# Altium schematic sheet I2C_Switch_temp_sens.SchDoc: Sayma RTM
size 420 x 297 mm; Author: G.Kasprowicz; CompanyName: WUT ISE; DrawnBy: G.Kasprowicz; Organization: WUT ISE; Address1: PW ISE; Address2: Nowowiejska 15/19 00-665 Warsaw; Address3: gkasprow@gmail.com; DocumentNumber: 18; Revision: 1.0; SheetNumber: 18; SheetTotal: 18; ModifiedBy: -; CheckedDate: -; Title2: I2C switches & sensors; DivGrp: WUT ISE; Designer: G.Kasprowicz; ModifiedDate: -; ProjectName: Sensor Box
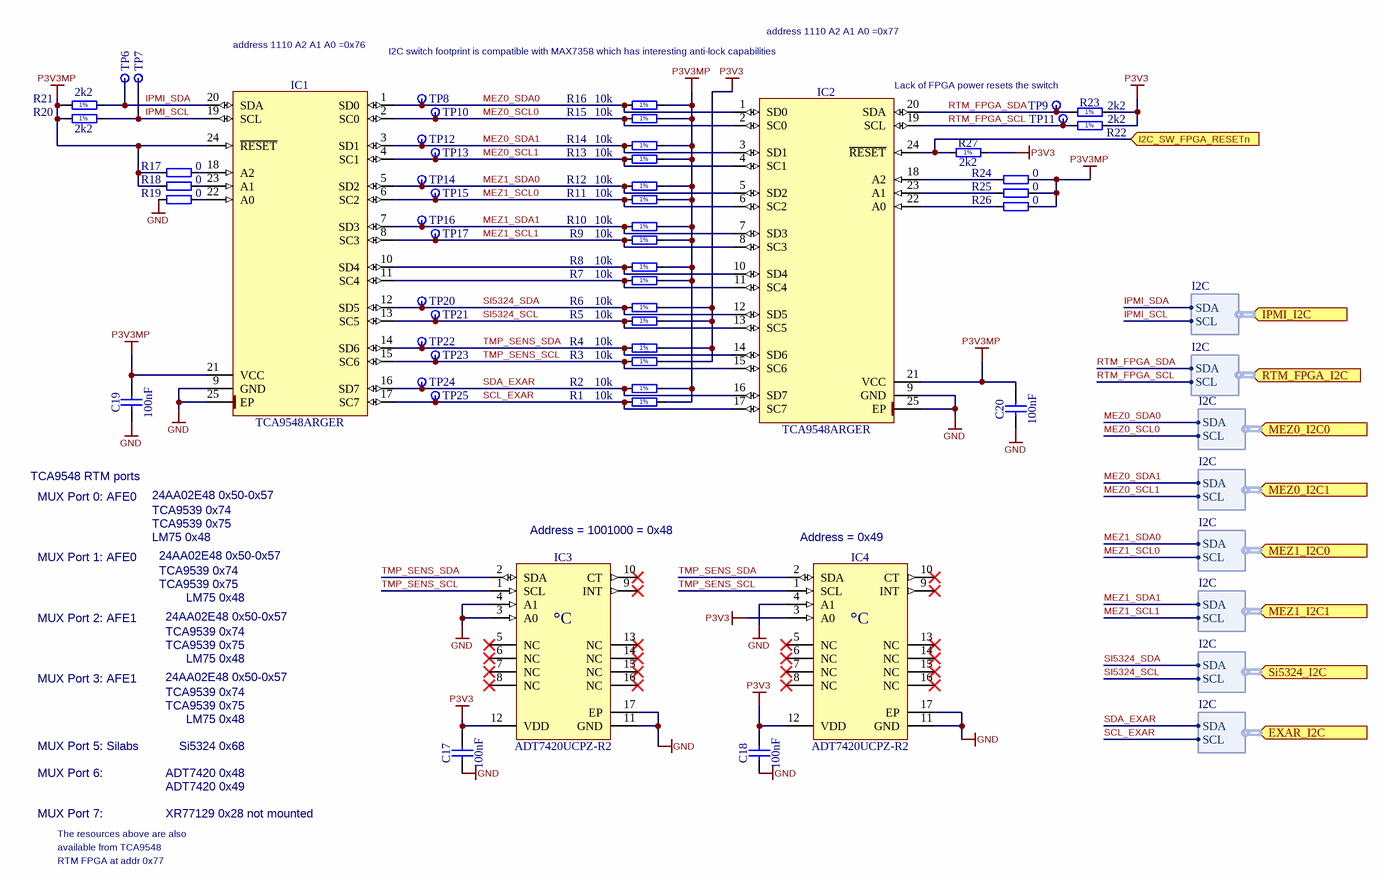
[diagram p0: I2C_Switch_temp_sens.SchDoc]

## Parts
C17  100nF  [CAPC0603X33N]
C18  100nF  [CAPC0603X33N]
C19  100nF  [CAPC0603X33N]
C20  100nF  [CAPC0603X33N]
IC1  TCA9548ARGER  [QFN50P400X400X100-25N-S220]
IC2  TCA9548ARGER  [QFN50P400X400X100-25N-S220]
IC3  ADT7420UCPZ-R2  [QFN65P400X400X80-17N-S270]
IC4  ADT7420UCPZ-R2  [QFN65P400X400X80-17N-S270]
R1  10k  [RESC1005X40N]
R2  10k  [RESC1005X40N]
R3  10k  [RESC1005X40N]
R4  10k  [RESC1005X40N]
R5  10k  [RESC1005X40N]
R6  10k  [RESC1005X40N]
R7  10k  [RESC1005X40N]
R8  10k  [RESC1005X40N]
R9  10k  [RESC1005X40N]
R10  10k  [RESC1005X40N]
R11  10k  [RESC1005X40N]
R12  10k  [RESC1005X40N]
R13  10k  [RESC1005X40N]
R14  10k  [RESC1005X40N]
R15  10k  [RESC1005X40N]
R16  10k  [RESC1005X40N]
R17  0  [RESC1005X40N]
R18  0  [RESC1005X40N]
R19  0  [RESC1005X40N]
R20  2k2  [RESC1005X40N]
R21  2k2  [RESC1005X40N]
R22  2k2  [RESC1005X40N]
R23  2k2  [RESC1005X40N]
R24  0  [RESC1005X40N]
R25  0  [RESC1005X40N]
R26  0  [RESC1005X40N]
R27  2k2  [RESC1005X40N]
TP6  Test Point  [TPS127]  (value not drawn)
TP7  Test Point  [TPS127]  (value not drawn)
TP8  Test Point  [TPS127]  (value not drawn)
TP9  Test Point  [TPS127]  (value not drawn)
TP10  Test Point  [TPS127]  (value not drawn)
TP11  Test Point  [TPS127]  (value not drawn)
TP12  Test Point  [TPS127]  (value not drawn)
TP13  Test Point  [TPS127]  (value not drawn)
TP14  Test Point  [TPS127]  (value not drawn)
TP15  Test Point  [TPS127]  (value not drawn)
TP16  Test Point  [TPS127]  (value not drawn)
TP17  Test Point  [TPS127]  (value not drawn)
TP20  Test Point  [TPS127]  (value not drawn)
TP21  Test Point  [TPS127]  (value not drawn)
TP22  Test Point  [TPS127]  (value not drawn)
TP23  Test Point  [TPS127]  (value not drawn)
TP24  Test Point  [TPS127]  (value not drawn)
TP25  Test Point  [TPS127]  (value not drawn)

## Ports
EXAR_I2C (in, harness I2C), I2C_SW_FPGA_RESETn (in), IPMI_I2C (in, harness I2C), MEZ0_I2C0 (in, harness I2C), MEZ0_I2C1 (in, harness I2C), MEZ1_I2C0 (in, harness I2C), MEZ1_I2C1 (in, harness I2C), RTM_FPGA_I2C (in, harness I2C), Si5324_I2C (in, harness I2C)

## Harnesses
I2C: SDA, SCL

## Nets
GND: C17.1 C18.1 C19.1 C20.1 IC1.9(GND) IC1.25(EP) IC2.9(GND) IC2.25(EP) IC3.3(A0) IC3.4(A1) IC3.11(GND) IC3.17(EP) IC4.4(A1) IC4.11(GND) IC4.17(EP) R19.1
P3V3: C17.2 C18.2 IC3.12(VDD) IC4.3(A0) IC4.12(VDD) R3.2 R4.2 R5.2 R6.2 R22.2 R23.2 R27.2
P3V3MP: C19.2 C20.2 IC1.21(VCC) IC1.24(~{RESET}) IC2.21(VCC) R1.2 R2.2 R7.2 R8.2 R9.2 R10.2 R11.2 R12.2 R13.2 R14.2 R15.2 R16.2 R17.1 R18.1 R20.1 R21.1 R24.2 R25.2 R26.2
I2C_SW_FPGA_RESETn: IC2.24(~{RESET}) R27.1 ; port I2C_SW_FPGA_RESETn
IPMI_SCL: IC1.19(SCL) R20.2 TP7.1 ; port IPMI_I2C.SCL
IPMI_SDA: IC1.20(SDA) R21.2 TP6.1 ; port IPMI_I2C.SDA
MEZ0_SCL0: IC1.2(SC0) IC2.2(SC0) R15.1 TP10.1 ; port MEZ0_I2C0.SCL
MEZ0_SCL1: IC1.4(SC1) IC2.4(SC1) R13.1 TP13.1 ; port MEZ0_I2C1.SCL
MEZ0_SDA0: IC1.1(SD0) IC2.1(SD0) R16.1 TP8.1 ; port MEZ0_I2C0.SDA
MEZ0_SDA1: IC1.3(SD1) IC2.3(SD1) R14.1 TP12.1 ; port MEZ0_I2C1.SDA
MEZ1_SCL0: IC1.6(SC2) IC2.6(SC2) R11.1 TP15.1 ; port MEZ1_I2C0.SCL
MEZ1_SCL1: IC1.8(SC3) IC2.8(SC3) R9.1 TP17.1 ; port MEZ1_I2C1.SCL
MEZ1_SDA0: IC1.5(SD2) IC2.5(SD2) R12.1 TP14.1 ; port MEZ1_I2C0.SDA
MEZ1_SDA1: IC1.7(SD3) IC2.7(SD3) R10.1 TP16.1 ; port MEZ1_I2C1.SDA
RTM_FPGA_SCL: IC2.19(SCL) R22.1 TP11.1 ; port RTM_FPGA_I2C.SCL
RTM_FPGA_SDA: IC2.20(SDA) R23.1 TP9.1 ; port RTM_FPGA_I2C.SDA
SCL_EXAR: IC1.17(SC7) IC2.17(SC7) R1.1 TP25.1 ; port EXAR_I2C.SCL
SDA_EXAR: IC1.16(SD7) IC2.16(SD7) R2.1 TP24.1 ; port EXAR_I2C.SDA
SI5324_SCL: IC1.13(SC5) IC2.13(SC5) R5.1 TP21.1 ; port Si5324_I2C.SCL
SI5324_SDA: IC1.12(SD5) IC2.12(SD5) R6.1 TP20.1 ; port Si5324_I2C.SDA
TMP_SENS_SCL: IC1.15(SC6) IC2.15(SC6) IC3.1(SCL) IC4.1(SCL) R3.1 TP23.1
TMP_SENS_SDA: IC1.14(SD6) IC2.14(SD6) IC3.2(SDA) IC4.2(SDA) R4.1 TP22.1
NetIC1_10: IC1.10(SD4) IC2.10(SD4) R8.1
NetIC1_11: IC1.11(SC4) IC2.11(SC4) R7.1
NetIC1_18: IC1.18(A2) R17.2
NetIC1_22: IC1.22(A0) R19.2
NetIC1_23: IC1.23(A1) R18.2
NetIC2_18: IC2.18(A2) R24.1
NetIC2_22: IC2.22(A0) R26.1
NetIC2_23: IC2.23(A1) R25.1

Not connected (* = marked no-connect by the designer): IC3 5(NC)* 6(NC)* 7(NC)* 8(NC)* 9(INT)* 10(CT)* 13(NC)* 14(NC)* 15(NC)* 16(NC)*; IC4 5(NC)* 6(NC)* 7(NC)* 8(NC)* 9(INT)* 10(CT)* 13(NC)* 14(NC)* 15(NC)* 16(NC)*

## Notes on the sheet
- address 1110 A2 A1 A0 =0x76
- I2C switch footprint is compatible with MAX7358 which has interesting anti-lock capabilities
- address 1110 A2 A1 A0 =0x77
- Lack of FPGA power resets the switch
- TCA9548 RTM ports
- MUX Port 0: AFE0
- LM75 0x48
- TCA9539 0x75
- TCA9539 0x74
- 24AA02E48 0x50-0x57
- (near IC3) Address = 1001000 = 0x48
- (near IC4) Address = 0x49
- MUX Port 1: AFE0
- MUX Port 2: AFE1
- MUX Port 5: Silabs
- MUX Port 3: AFE1
- Si5324 0x68
- MUX Port 6:
- ADT7420 0x48
- ADT7420 0x49
- MUX Port 7:
- The resources above are also
- RTM FPGA at addr 0x77
- available from TCA9548
- XR77129 0x28 not mounted
- Project/Equipment
- Document
- Designer
- Drawn by
- Check.by
- Copyright WUT ISE 2018.
  This documentation describes Open Hardware and is licensed under the CERN OHL v.1.1. You may redistribute and modify this documentation under the terms of the CERN OHL v.1.1. (http://ohwr.org/CERNOHL). This documentation is distributed WITHOUT ANY EXPRESS OR IMPLIED WARRANTY, INCLUDING OF MERCHANTABILITY, SATISFACTORY QUALITY AND FITNESS FOR A PARTICULAR PURPOSE. Please see the CERN OHL v.1.1 for applicable conditions.
- Contact
- File
- Last Mod.
- Print Date
- Sheet
- Size
- A3
- of
- Rev
- (in symbol ADT7420UCPZ-R2) °C
- (in symbol R0402_2K2_1%_0.0625W_100PPM) 1%
- (in symbol R0402_10K_1%_0.0625W_100PPM) 1%

## Library data of the parts
C17-C20 = CC0201_100NF_6.3V_10%_X5R: Non-polarised capacitor; Manufacturer: GENERIC; Manufacturer1 Part Number: 02016D104KAT2A; Part Description: SMD Multilayer Chip Ceramic Capacitor; TC: X5R; Tolerance: ±10%; Voltage: 6.3V; Case: 0201; Manufacturer Part Number: CC0201_100NF_6.3V_10%_X5R; Manufacturer1 Example: AVX; Part Number: CC0201_100NF_6.3V_10%_X5R; Pin Count: 2; SMD: Yes; Status: Not Recommended; Value: 100nF; Component Kind: Standard; Component Type: Standard; Mounted: Yes; Socket: No; Sense: No; Manufacturer1 ComponentHeight: 0.33mm; HelpURL: \\cern.ch\dfs\Applications\Altium\Datasheets\CC0201_X5R_AVX.pdf; Author: CERN DEM JLC; CreateDate: 03.12.2007; LatestRevisionDate: 03.12.2007
IC1 IC2 = TCA9548ARGER: Low Voltage 8-Channel I2C Switch With Reset; Manufacturer: TEXAS INSTRUMENTS; Bonding: No; PressFit: No; Case: QFN24; ComponentHeight: 1mm; Device: TCA9548ARGER; Manufacturer Part Number: TCA9548ARGER; Mounted: Yes; PackageDescription: QFN, 0.50mm Pitch, Square; 24 Pin, 4.00mm L X 4.00mm W X 1.00mm H body (w/thermal tab 2.2 X 2.2mm), IPC Medium Density; Part Description: Low Voltage 8-Channel I2C Switch With Reset; Part Number: TCA9548ARGER; Pin Count: 25; Sense: No; SMD: Yes; Socket: No; Component Kind: Standard; Component Type: Standard; Author: CERN DEM JLC; HelpURL: \\cern.ch\dfs\Applications\Altium\Datasheets\TCA9548ARGER.pdf; CreateDate: 07.07.2014; LatestRevisionDate: 07.07.2014
IC3 IC4 = ADT7420UCPZ-R2: ±0.25°C Accurate, 16-Bit Digital I2C Temperature Sensor; Manufacturer: ANALOG DEVICES; Part Description: -20° to +105°C ±0.25°C Accurate, 16-Bit Digital I2C Temperature Sensor; Bonding: No; PressFit: No; Case: QFN16; ComponentHeight: 0.8mm; Device: ADT7420UCPZ-R2; Manufacturer Part Number: ADT7420UCPZ-R2; Mounted: Yes; PackageDescription: QFN, 0.65mm Pitch, Square; 16 Pin, 4.00mm L X 4.00mm W X 0.80mm H Body (w/thermal tab 2.7 X 2.7mm),  IPC Medium Density; Part Number: ADT7420UCPZ-R2; Pin Count: 8; Sense: No; SMD: Yes; Socket: No; Component Kind: Standard; Component Type: Standard; HelpURL: \\cern.ch\dfs\Applications\Altium\Datasheets\ADT7420UCPZ-R2.pdf; Author: CERN DEM JLC; CreateDate: 21.02.2013; LatestRevisionDate: 21.02.2013
R1-R16 = R0402_10K_1%_0.0625W_100PPM: Resistor - 1%; Manufacturer: GENERIC; Manufacturer1 Part Number: 232270671003L; Part Description: General Purpose Thick Film Chip Resistor; TC: ±100ppm/°C; PressFit: No; Case: 0402; Manufacturer Part Number: R0402_10K_1%_0.0625W_100PPM; Manufacturer1 ComponentHeight: 0.4mm; Manufacturer1 Example: YAGEO PHYCOMP; Part Number: R0402_10K_1%_0.0625W_100PPM; Pin Count: 2; Power: 0.0625W; Sense: No; SMD: Yes; Status: Not Recommended; Tolerance: ±1%; Value: 10k; Component Kind: Standard; Component Type: Standard; Mounted: Yes; Socket: No; HelpURL: \\cern.ch\dfs\Applications\Altium\Datasheets\R0402_Phycomp_RC0402.pdf; Author: CERN DEM JLC; CreateDate: 03.12.2007; LatestRevisionDate: 17.10.2012
R17-R19 R24-R26 = R0402_0R_JUMPER: Resistor; Manufacturer: GENERIC; Manufacturer1 Part Number: 232270591001L; Part Description: 1A (0.05R Max DC Resistance) Zero Ohm Jumper; PressFit: No; Case: 0402; Manufacturer Part Number: R0402_0R_JUMPER; Manufacturer1 ComponentHeight: 0.4mm; Manufacturer1 Example: YAGEO PHYCOMP; Part Number: R0402_0R_JUMPER; Pin Count: 2; Sense: No; SMD: Yes; Status: Not Recommended; Value: 0; Component Kind: Standard; Component Type: Standard; Mounted: Yes; Socket: No; HelpURL: \\cern.ch\dfs\Applications\Altium\Datasheets\R0402_Phycomp_RC0402.pdf; Author: CERN DEM JLC; CreateDate: 03.12.2007; LatestRevisionDate: 17.10.2012
R20-R23 R27 = R0402_2K2_1%_0.0625W_100PPM: Resistor - 1%; Manufacturer: GENERIC; Manufacturer1 Part Number: 232270672202L; Part Description: General Purpose Thick Film Chip Resistor; TC: ±100ppm/°C; PressFit: No; Case: 0402; Manufacturer Part Number: R0402_2K2_1%_0.0625W_100PPM; Manufacturer1 ComponentHeight: 0.4mm; Manufacturer1 Example: YAGEO PHYCOMP; Part Number: R0402_2K2_1%_0.0625W_100PPM; Pin Count: 2; Power: 0.0625W; Sense: No; SMD: Yes; Status: Not Recommended; Tolerance: ±1%; Value: 2k2; Component Kind: Standard; Component Type: Standard; Mounted: Yes; Socket: No; HelpURL: \\cern.ch\dfs\Applications\Altium\Datasheets\R0402_Phycomp_RC0402.pdf; Author: CERN DEM JLC; CreateDate: 03.12.2007; LatestRevisionDate: 17.10.2012
TP6-TP17 TP20-TP25 = SMD_PAD_1.27X1.27MM: Part Description: 1.27mm x 1.27mm PCB Copper Area (SMD Test Point); Mounted: No; ComponentHeight: 0mm; Family: Test Point; Part Number: SMD_PAD_1.27X1.27MM; Pin Count: 1; Sense: No; SMD: Yes; Socket: No; Status: None; Component Kind: Standard (No BOM); Component Type: Standard (No BOM); HelpURL: Undefined; Author: CERN DEM JLC; CreateDate: 12.01.2008; LatestRevisionDate: 12.01.2008; PackageDescription: 1.27mm x 1.27mm PCB Copper Area (SMD Test Point)